# Altium schematic sheet ES8388.SchDoc
size A3; SheetNumber: 3; SheetTotal: 3
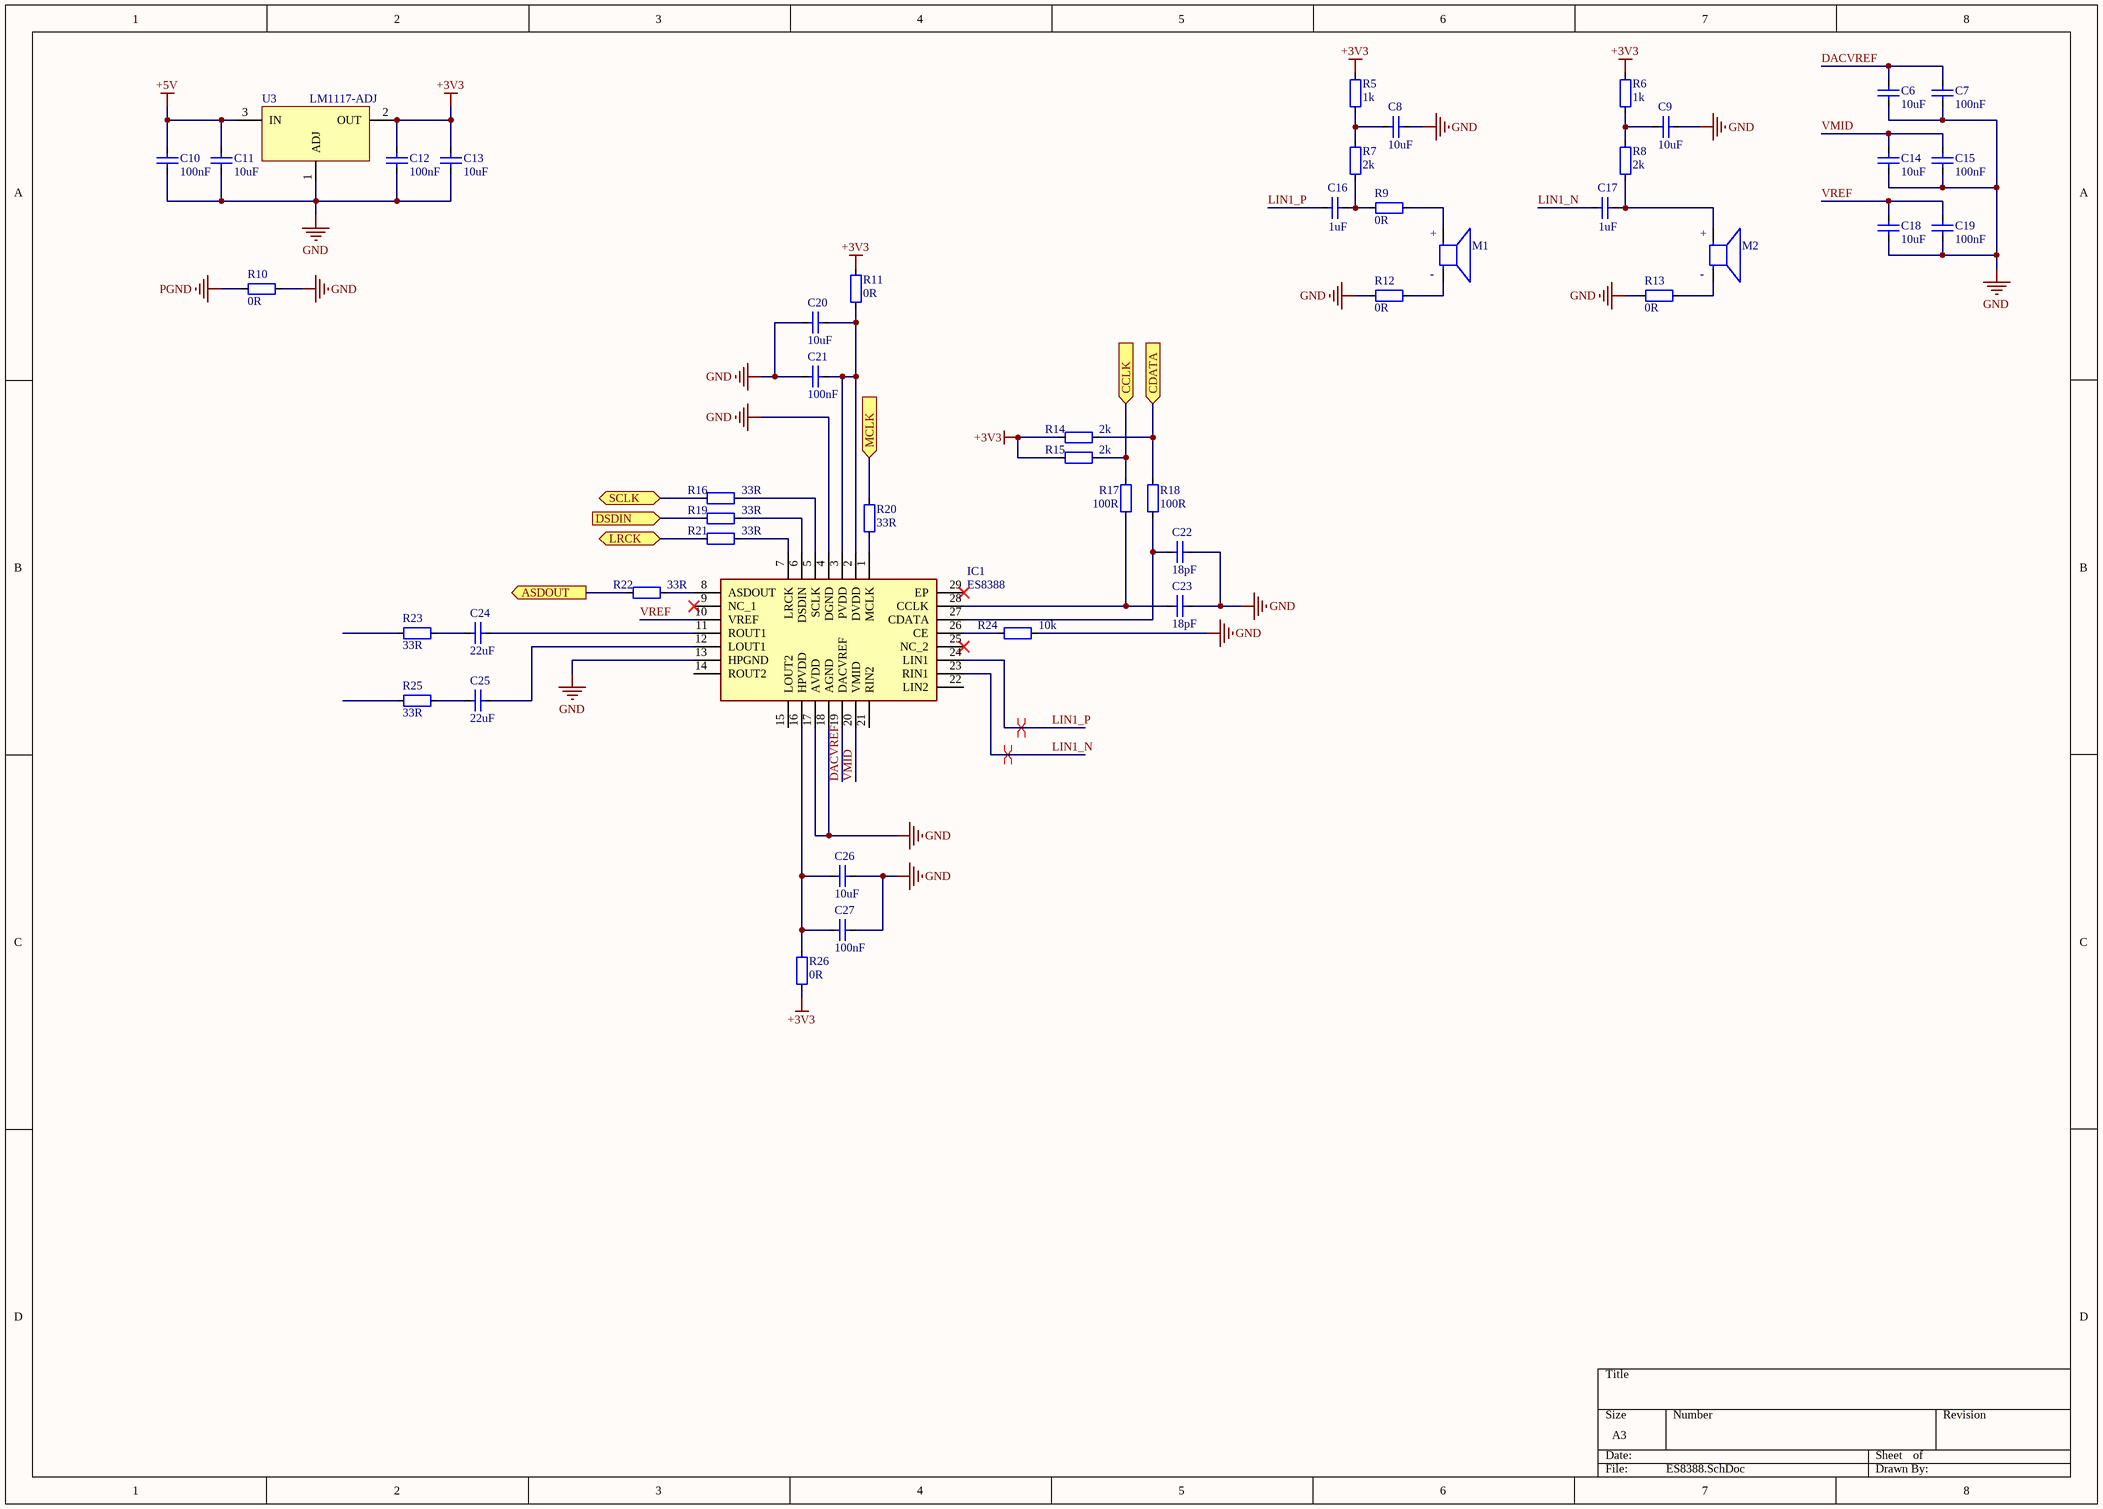
[diagram p0: ES8388.SchDoc]

## Parts
C6  10uF  [CAP_0603]
C7  100nF  [CAP_0603]
C8  10uF  [CAP_0603]
C9  10uF  [CAP_0603]
C10  100nF  [CAP_0805]
C11  10uF  [CAP_0805]
C12  100nF  [CAP_0805]
C13  10uF  [CAP_0805]
C14  10uF  [CAP_0603]
C15  100nF  [CAP_0603]
C16  1uF  [CAP_0603]
C17  1uF  [CAP_0603]
C18  10uF  [CAP_0603]
C19  100nF  [CAP_0603]
C20  10uF  [CAP_0603]
C21  100nF  [CAP_0603]
C22  18pF  [CAP_0603]
C23  18pF  [CAP_0603]
C24  22uF  [CAP_0805]
C25  22uF  [CAP_0805]
C26  10uF  [CAP_0603]
C27  100nF  [CAP_0603]
IC1  ES8388  [ES8388]
M1  Microphone  [Microphone]  (value not drawn)
M2  Microphone  [Microphone]  (value not drawn)
R5  1k  [RES-SMD-0603]
R6  1k  [RES-SMD-0603]
R7  2k  [RES-SMD-0603]
R8  2k  [RES-SMD-0603]
R9  0R  [RES-SMD-0603]
R10  0R  [RES-SMD-0603]
R11  0R  [RES-SMD-0603]
R12  0R  [RES-SMD-0603]
R13  0R  [RES-SMD-0603]
R14  2k  [RES-SMD-0603]
R15  2k  [RES-SMD-0603]
R16  33R  [RES-SMD-0603]
R17  100R  [RES-SMD-0603]
R18  100R  [RES-SMD-0603]
R19  33R  [RES-SMD-0603]
R20  33R  [RES-SMD-0603]
R21  33R  [RES-SMD-0603]
R22  33R  [RES-SMD-0603]
R23  33R  [RES-SMD-0603]
R24  10k  [RES-SMD-0603]
R25  33R  [RES-SMD-0603]
R26  0R  [RES-SMD-0603]
U3  LM1117-ADJ  [LM1117-SOP]

## Ports
ASDOUT (out), CCLK (in), CDATA (in), DSDIN (in), LRCK (bidir), MCLK (in), SCLK (bidir)

## Nets
+3V3: C12.2 C13.2 R5.1 R6.1 R11.2 R14.1 R15.1 R26.1 U3.2(OUT)
+5V: C10.2 C11.2 U3.3(IN)
GND: C6.2 C7.1 C8.1 C9.1 C10.1 C11.1 C12.1 C13.1 C14.2 C15.1 C18.2 C19.1 C20.2 C21.1 C22.2 C23.2 C26.1 C27.2 IC1.4(DGND) IC1.13(HPGND) IC1.17(AVDD) IC1.18(AGND) R10.1 R12.2 R13.2 R24.1 U3.1(ADJ)
PGND: R10.2
ASDOUT: R22.1 ; port ASDOUT
CCLK: R15.2 R17.1 ; port CCLK
CDATA: R14.2 R18.1 ; port CDATA
DACVREF: C6.1 C7.2 IC1.19(DACVREF)
DSDIN: R19.1 ; port DSDIN
LIN1_N: C17.1 IC1.23(RIN1)
LIN1_P: C16.1 IC1.24(LIN1)
LRCK: R21.1 ; port LRCK
MCLK: R20.2 ; port MCLK
SCLK: R16.1 ; port SCLK
VMID: C14.1 C15.2 IC1.20(VMID)
VREF: C18.1 C19.2 IC1.10(VREF)
NetC8_2: C8.2 R5.2 R7.1
NetC9_2: C9.2 R6.2 R8.1
NetC16_2: C16.2 R7.2 R9.2
NetC17_2: C17.2 M2.P(POS) R8.2
NetC20_1: C20.1 C21.2 IC1.2(DVDD) IC1.3(PVDD) R11.1
NetC22_1: C22.1 IC1.27(CDATA) R18.2
NetC23_1: C23.1 IC1.28(CCLK) R17.2
NetC24_1: C24.1 IC1.11(ROUT1)
NetC24_2: C24.2 R23.1
NetC25_1: C25.1 IC1.12(LOUT1)
NetC25_2: C25.2 R25.1
NetC26_2: C26.2 C27.1 IC1.16(HPVDD) R26.2
NetIC1_1: IC1.1(MCLK) R20.1
NetIC1_5: IC1.5(SCLK) R16.2
NetIC1_6: IC1.6(DSDIN) R19.2
NetIC1_7: IC1.7(LRCK) R21.2
NetIC1_8: IC1.8(ASDOUT) R22.2
NetIC1_26: IC1.26(CE) R24.2
NetM1_N: M1.N(NEG) R12.1
NetM1_P: M1.P(POS) R9.1
NetM2_N: M2.N(NEG) R13.1

Not connected (* = marked no-connect by the designer): IC1 9(NC_1)* 14(ROUT2) 15(LOUT2) 21(RIN2) 22(LIN2) 25(NC_2)* 29(EP)*; R23 2; R25 2

## Layout directives
differential pair: LIN1_N, LIN1_P

## Notes on the sheet
- (in symbol Microphone) +; -

## Library data of the parts
C6-C27 = CapSMD: Capacitor; Value: 33p; Published: 8-Jun-2000; LatestRevisionDate: 17-Jul-2002; LatestRevisionNote: Re-released for DXP Platform.; PackageReference: RAD-0.3; Publisher: Altium Limited
R5-R26 = Resistor - SMD: Resistor; Manufacturer: Generic Components; Class: Passive; Published: 08/06/2000; Publisher: Altium Hobart Technology Centre
U3 = LM1117-ADJ: 800mA Low-Dropout Linear Regulator; Creator: Nguyen Ba Bien; Website: http://group3i.net